# Altium project TU_ADV_PRJ.PrjPcb
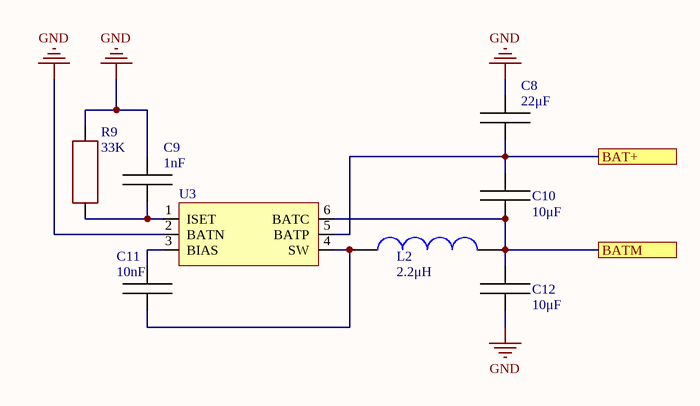
[diagram p0: 2S_BATTERY_BALANCER_SCH.SchDoc]
6 sheets, 59 parts. Net scope: hierarchical (ports join the sheet entries above them; power ports are global).
Board file: TU_ADV_PCB.PcbDoc
Sheets:
  2S_BATTERY_BALANCER_SCH.SchDoc
  2S_BATTERY_CHARGER_SCH.SchDoc
  1S_BATTERY_CHARGER_SCH.SchDoc
  TU_MCU.SchDoc
  2S_BATTERY_PROTECTION_SCH.SchDoc
  FLASHLIGHT_MAIN_SCH.SchDoc

## Sheet 2S_BATTERY_BALANCER_SCH.SchDoc
size 300 x 200 mm

### Parts
C8  value 22μF  [CAP: 1206]  (hidden comment: Cap_1206)
C9  value 1nF  [CAP: 0402]  (hidden comment: Cap_0402)
C10  value 10μF  [CAP: 0603]  (hidden comment: Cap_0603)
C11  value 10nF  [CAP: 0402]  (hidden comment: Cap_0402)
C12  value 10μF  [CAP: 0603]  (hidden comment: Cap_0603)
L2  value 2.2μH  [CD43]  (hidden comment: CD43)
R9  value 33K  [RES: 0402]
U3  ETA3000  [SOT-23-6]  (value not drawn)

### Ports
BAT+, BATM

### Nets
GND: C8.2 C9.2 C12.2 R9.2 U3.2(BATN)
NetC8_1: C8.1 C10.1 U3.5(BATP) ; port BAT+
NetC9_1: C9.1 R9.1 U3.1(ISET)
NetC10_2: C10.2 C12.1 L2.1 U3.6(BATC) ; port BATM
NetC11_1: C11.1 L2.2 U3.4(SW)
NetC11_2: C11.2 U3.3(BIAS)

### Library data of the parts
C8 = Cap_1206: TypeDielectric: X7R(X5R); Voltage: ??V; Package/Case: 1206; Temperature: -55...+125°C(-55...+85°C); Product Category: Capacitors
C9 C11 = Cap_0402: TypeDielectric: X7R(X5R); Voltage: ??V; Package/Case: 0402; Temperature: -55...+125°C(-55...+85°C); Product Category: Capacitors
C10 C12 = Cap_0603: TypeDielectric: X7R(X5R); Voltage: ??V; Package/Case: 0603; Temperature: -55...+125°C(-55...+85°C); Product Category: Capacitors
L2 = CD43: SMD Power Inductor; Manufacturer: SUMIDA; Datasheet: https://products.sumida.com/products/pdf/CD43.pdf; HelpURL: https://aliexpress.ru/item/1005002090028747.html?sku_id=12000018707218161&spm=a2g2w.productlist.search_results.13.550c3fc1XziZsU; Product Category: Inductors
R9 = Resistor_0402: Tolerance: ±5%; Product Category: Resistors; Package/Case: 0402; Temperature: -55...+125°C
U3 = ETA3000: Inductive cell balancer; Manufacturer: ETA; Datasheet: https://datasheetspdf.com/mobile/1424958/ETA/ETA3000/1; HelpURL: https://aliexpress.ru/item/1005002742533593.html?sku_id=12000021935942334; Package/Case: SOT-23-6; Product Category: Battery balancers; Value: ETA3000

## Sheet 2S_BATTERY_CHARGER_SCH.SchDoc
size 300 x 200 mm
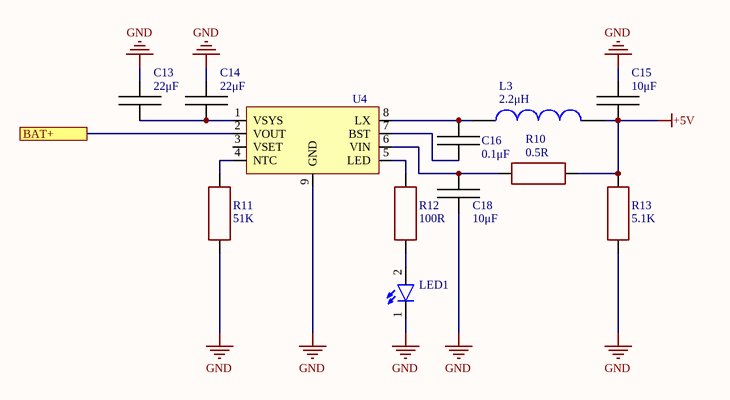
[diagram p1: 2S_BATTERY_CHARGER_SCH.SchDoc]

### Parts
C13  value 22μF  [CAP: 0603]  (hidden comment: Cap_0603)
C14  value 22μF  [CAP: 0603]  (hidden comment: Cap_0603)
C15  value 10μF  [CAP: 0603]  (hidden comment: Cap_0603)
C16  value 0.1μF  [CAP: 0603]  (hidden comment: Cap_0603)
C18  value 10μF  [CAP: 0603]  (hidden comment: Cap_0603)
L3  value 2.2μH  [CD43]  (hidden comment: CD43)
LED1  LED_0603  [LED_0603]  (value not drawn)
R10  value 0.5R  [RES: 0603]  (hidden comment: Resistor_0603)
R11  value 51K  [RES: 0603]  (hidden comment: Resistor_0603)
R12  value 100R  [RES: 0603]  (hidden comment: Resistor_0603)
R13  value 5.1K  [RES: 0603]  (hidden comment: Resistor_0603)
U4  IP2325  [ESOP-8]  (value not drawn)

### Ports
BAT+

### Nets
+5V: C15.2 L3.1 R10.1 R13.2
GND: C13.1 C14.1 C15.1 C18.1 LED1.1 R11.1 R13.1 U4.9(GND)
NetC13_2: C13.2 C14.2 U4.1(VSYS)
NetC16_1: C16.1 U4.7(BST)
NetC16_2: C16.2 L3.2 U4.8(LX)
NetC18_2: C18.2 R10.2 U4.6(VIN)
NetLED1_2: LED1.2 R12.1
NetR11_2: R11.2 U4.4(NTC)
NetR12_2: R12.2 U4.5(LED)
NetU4_2: U4.2(VOUT) ; port BAT+

Not connected (* = marked no-connect by the designer): U4 3(VSET)

### Library data of the parts
C13-C16 C18 = Cap_0603: TypeDielectric: X7R(X5R); Voltage: ??V; Package/Case: 0603; Temperature: -55...+125°C(-55...+85°C); Product Category: Capacitors
L3 = CD43: SMD Power Inductor; Manufacturer: SUMIDA; Datasheet: https://products.sumida.com/products/pdf/CD43.pdf; HelpURL: https://aliexpress.ru/item/1005002090028747.html?sku_id=12000018707218161&spm=a2g2w.productlist.search_results.13.550c3fc1XziZsU; Product Category: Inductors
R10-R13 = Resistor_0603: Tolerance: ±5%; Package/Case: 0603; Temperature: -55...+125°C; Product Category: Resistors
U4 = IP2325: 2s charge Module; Manufacturer: INJOINIC; Datasheet: http://www.injoinic.com/wwwroot/uploads/files/20230913/d8e5944686d69fa501fe83e437133f8d.pdf; HelpURL: https://aliexpress.ru/item/1005005892683023.html?sku_id=12000034732384666; Package/Case: ESOP-8; Product Category: Charge modules; Value: IP2325
LED1 = LED_0603: Product Category: LED; Value: LED_0603

## Sheet 1S_BATTERY_CHARGER_SCH.SchDoc
size 300 x 200 mm
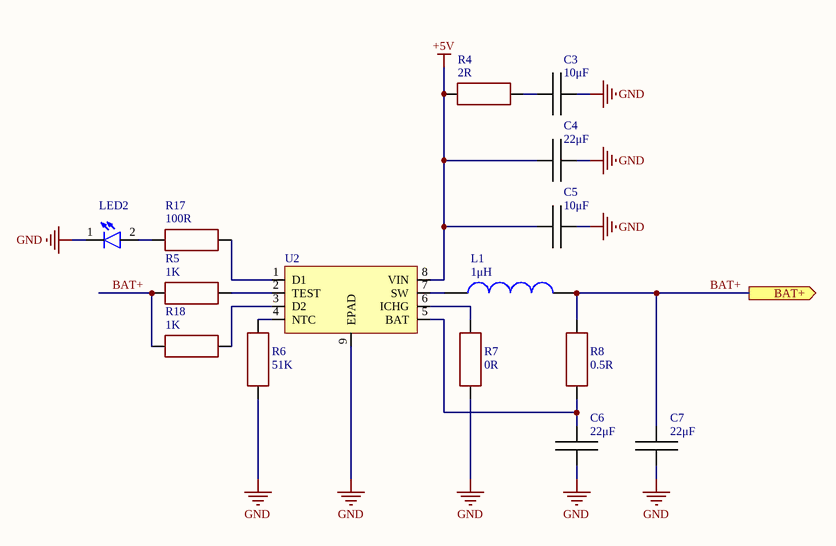
[diagram p2: 1S_BATTERY_CHARGER_SCH.SchDoc]

### Parts
C3  value 10μF  [CAP: 0603]  (hidden comment: Cap_0603)
C4  value 22μF  [CAP: 0603]  (hidden comment: Cap_0603)
C5  value 10μF  [CAP: 0603]  (hidden comment: Cap_0603)
C6  value 22μF  [CAP: 0603]  (hidden comment: Cap_0603)
C7  value 22μF  [CAP: 0603]  (hidden comment: Cap_0603)
L1  value 1μH  [CDRH74]  (hidden comment: CDRH74)
LED2  LED_0603  [LED_0603]  (value not drawn)
R4  value 2R  [RES: 0603]  (hidden comment: Resistor_0603)
R5  value 1K  [RES: 0603]  (hidden comment: Resistor_0603)
R6  value 51K  [RES: 0603]  (hidden comment: Resistor_0603)
R7  value 0R  [RES: 0603]  (hidden comment: Resistor_0603)
R8  value 0.5R  [RES: 0603]  (hidden comment: Resistor_0603)
R17  value 100R  [RES: 0603]  (hidden comment: Resistor_0603)
R18  value 1K  [RES: 0603]  (hidden comment: Resistor_0603)
U2  IP2312  [ESOP-8]  (value not drawn)

### Ports
BAT+ (out)

### Nets
+5V: C4.2 C5.2 R4.1 U2.8(VIN)
GND: C3.1 C4.1 C5.1 C6.2 C7.2 LED2.1 R6.1 R7.2 U2.9(EPAD)
BAT+: C7.1 L1.1 R5.1 R8.2 R18.1 ; port BAT+
NetC3_2: C3.2 R4.2
NetC6_1: C6.1 R8.1 U2.5(BAT)
NetL1_2: L1.2 U2.7(SW)
NetLED2_2: LED2.2 R17.1
NetR5_2: R5.2 U2.2(TEST)
NetR6_2: R6.2 U2.4(NTC)
NetR7_1: R7.1 U2.6(ICHG)
NetR17_2: R17.2 U2.1(D1)
NetR18_2: R18.2 U2.3(D2)

### Library data of the parts
C3-C7 = Cap_0603: TypeDielectric: X7R(X5R); Voltage: ??V; Package/Case: 0603; Temperature: -55...+125°C(-55...+85°C); Product Category: Capacitors
L1 = CDRH74: SMD Power Inductor; Manufacturer: SUMIDA; Datasheet: https://radiokomponent.com.ua/pdf/trans/CDRH74.pdf; HelpURL: https://aliexpress.ru/item/1005004321960425.html?sku_id=12000028751500104&spm=a2g2w.productlist.search_results.7.529b6cc4mPaVds; Product Category: Inductors
R4-R8 R17 R18 = Resistor_0603: Tolerance: ±5%; Package/Case: 0603; Temperature: -55...+125°C; Product Category: Resistors
U2 = IP2312: 1s charge module; Manufacturer: INJOINIC; Datasheet: https://datasheet.lcsc.com/lcsc/2304140030_INJOINIC-IP2312-4V35_C605433.pdf; HelpURL: https://aliexpress.ru/item/1005006314271382.html?spm=a2g2w.favourites.mywishlist.41.12044aa670bhdZ&sku_id=12000036725210626; Package/Case: ESOP-8; Product Category: Charge modules; Value: IP2312
LED2 = LED_0603: Product Category: LED; Value: LED_0603

## Sheet TU_MCU.SchDoc
size 500 x 500 mm
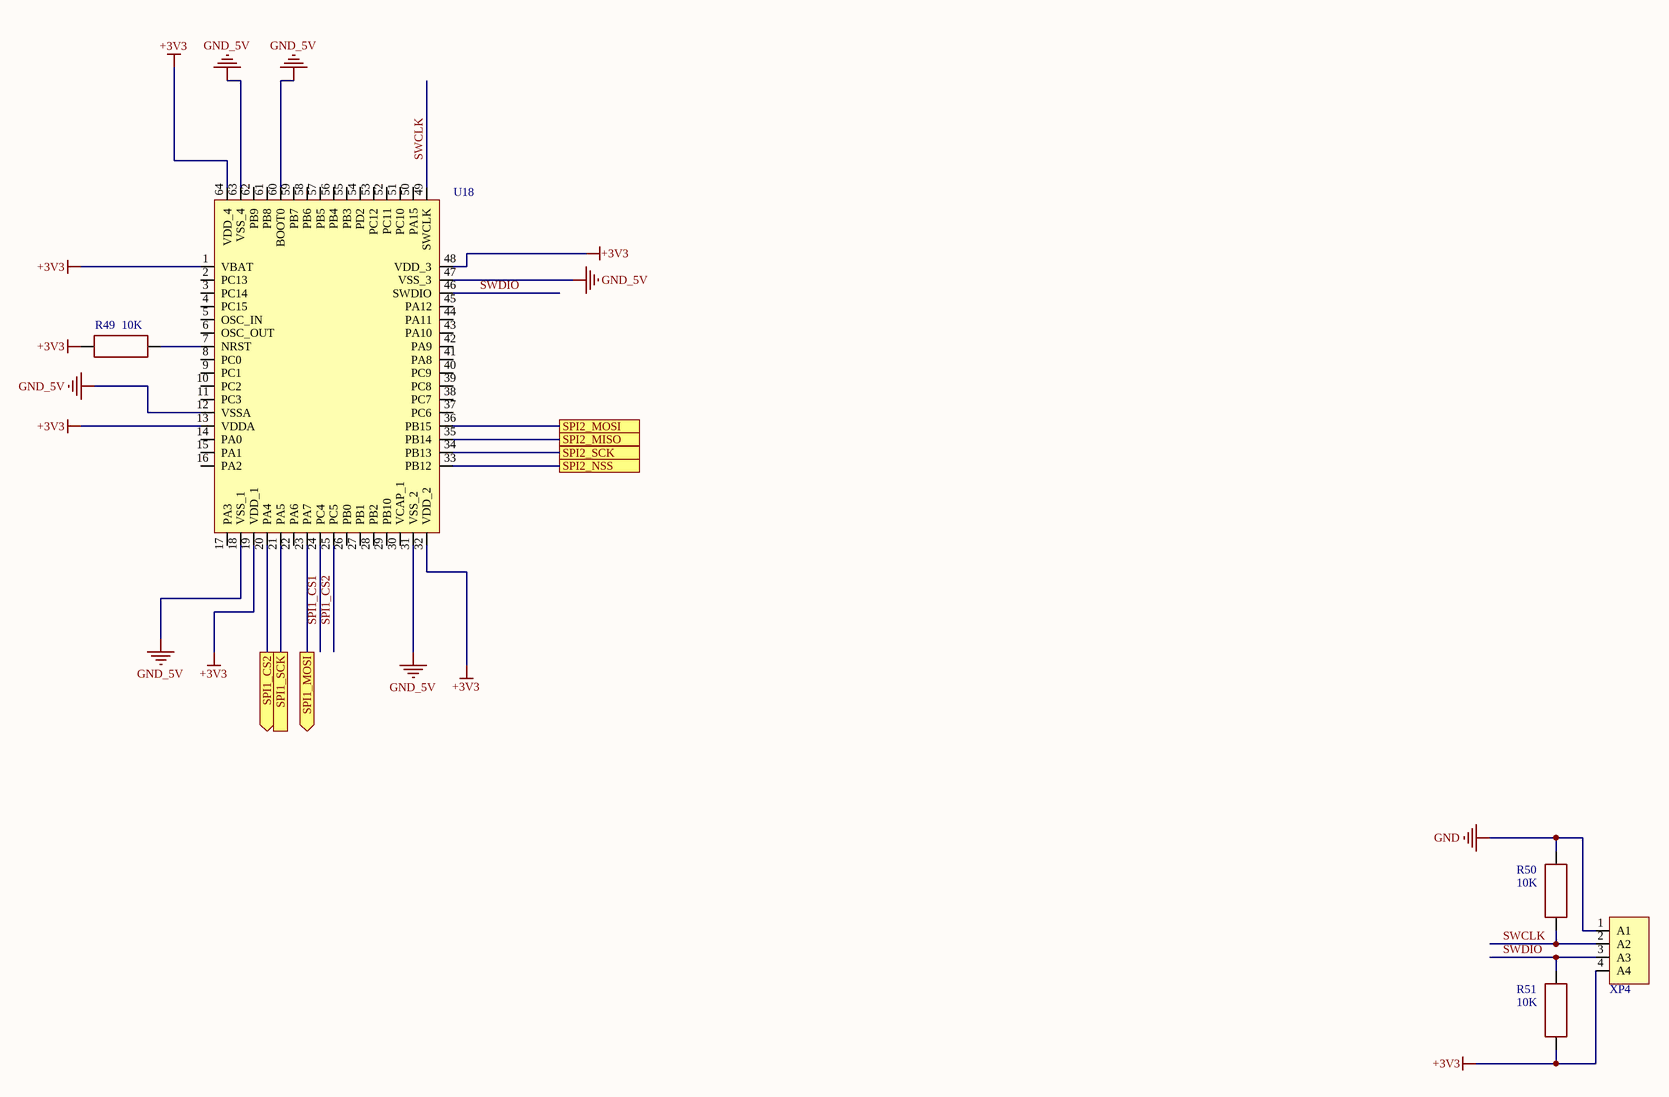
[diagram p3: TU_MCU.SchDoc]

### Parts
R49  value 10K  [RES: 0402]
R50  value 10K  [RES: 0402]
R51  value 10K  [RES: 0402]
U18  STM32F413RGT6  [LQFP-64]  (value not drawn)
XP4  PLS-6 (DS1021-1x6)  [PLS-4 (DS1021-1x4)]  (value not drawn)

### Ports
SPI1_CS2 (out), SPI1_MOSI (out), SPI1_SCK, SPI2_MISO, SPI2_MOSI, SPI2_NSS, SPI2_SCK

### Nets
+3V3: R49.1 R51.2 U18.1(VBAT) U18.13(VDDA) U18.19(VDD_1) U18.32(VDD_2) U18.48(VDD_3) U18.64(VDD_4) XP4.4(A4)
GND: R50.1 XP4.1(A1)
GND_5V: U18.12(VSSA) U18.18(VSS_1) U18.31(VSS_2) U18.47(VSS_3) U18.60(BOOT0) U18.63(VSS_4)
SPI1_CS1: U18.24(PC4)
SPI1_CS2: U18.25(PC5)
SWCLK: R50.2 U18.49(SWCLK) XP4.2(A2)
SWDIO: R51.1 U18.46(SWDIO) XP4.3(A3)
NetR49_2: R49.2 U18.7(NRST)
NetU18_20: U18.20(PA4) ; port SPI1_CS2
NetU18_21: U18.21(PA5) ; port SPI1_SCK
NetU18_23: U18.23(PA7) ; port SPI1_MOSI
NetU18_33: U18.33(PB12) ; port SPI2_NSS
NetU18_34: U18.34(PB13) ; port SPI2_SCK
NetU18_35: U18.35(PB14) ; port SPI2_MISO
NetU18_36: U18.36(PB15) ; port SPI2_MOSI

Not connected (* = marked no-connect by the designer): U18 2(PC13) 3(PC14) 4(PC15) 5(OSC_IN) 6(OSC_OUT) 8(PC0) 9(PC1) 10(PC2) 11(PC3) 14(PA0) 15(PA1) 16(PA2) 17(PA3) 22(PA6) 26(PB0) 27(PB1) 28(PB2) 29(PB10) 30(VCAP_1) 37(PC6) 38(PC7) 39(PC8) 40(PC9) 41(PA8) 42(PA9) 43(PA10) 44(PA11) 45(PA12) 50(PA15) 51(PC10) 52(PC11) 53(PC12) 54(PD2) 55(PB3) 56(PB4) 57(PB5) 58(PB6) 59(PB7) 61(PB8) 62(PB9)

### Library data of the parts
R49-R51 = Resistor_0402: Tolerance: ±5%; Product Category: Resistors; Package/Case: 0402; Temperature: -55...+125°C
U18 = STM32F413RGT6: ARM Microcontrollers - MCU High-performance access line, Arm Cortex-M4 core DSP & FPU, 1 MByte of Flash 100; Manufacturer: STMicroelectronics; Datasheet: https://eu.mouser.com/datasheet/2/389/stm32f413cg-1851205.pdf; HelpURL: https://eu.mouser.com/ProductDetail/STMicroelectronics/STM32F413RGT6?qs=FNcb6ahWXRyREY%252BFzgYY7A%3D%3D; Package/Case: LQFP-64; Product Category: Microcontrollers
XP4 = PLS-4 (DS1021-1x4): Board to Board, Surface Mount, Single row, 6 Positions, 2.54mm, Vertical.; Manufacturer: Connfly; Datasheet: https://static.chipdip.ru/lib/977/DOC005977245.pdf; HelpURL: https://www.chipdip.by/product/pls-4; Product Category: Connectors

## Sheet 2S_BATTERY_PROTECTION_SCH.SchDoc
size 299 x 199 mm
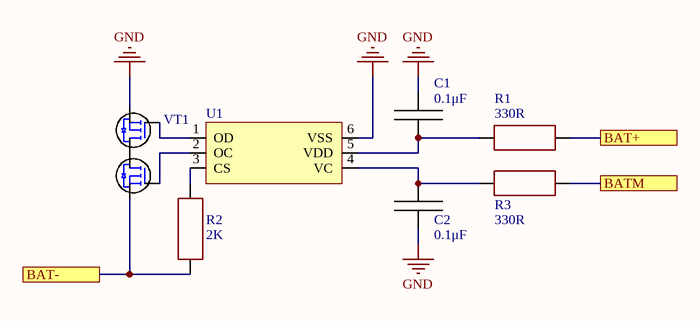
[diagram p4: 2S_BATTERY_PROTECTION_SCH.SchDoc]

### Parts
C1  value 0.1μF  [CAP: 0402]  (hidden comment: Cap_0402)
C2  value 0.1μF  [CAP: 0402]  (hidden comment: Cap_0402)
R1  value 330R  [RES: 0402]
R2  value 2K  [RES: 0402]
R3  value 330R  [RES: 0402]
U1  HY2120  [SOT-23-6]  (value not drawn)
VT1  8205A  [SOT-23-6]  (value not drawn)

### Ports
BAT+, BAT-, BATM

### Nets
GND: C1.2 C2.1 U1.6(VSS) VT1.1
NetC1_1: C1.1 R1.1 U1.5(VDD)
NetC2_2: C2.2 R3.1 U1.4(VC)
NetR1_2: R1.2 ; port BAT+
NetR2_1: R2.1 VT1.3 ; port BAT-
NetR2_2: R2.2 U1.3(CS)
NetR3_2: R3.2 ; port BATM
NetU1_1: U1.1(OD) VT1.6
NetU1_2: U1.2(OC) VT1.4
NetVT1_2: VT1.2 VT1.5

### Library data of the parts
C1 C2 = Cap_0402: TypeDielectric: X7R(X5R); Voltage: ??V; Package/Case: 0402; Temperature: -55...+125°C(-55...+85°C); Product Category: Capacitors
R1-R3 = Resistor_0402: Tolerance: ±5%; Product Category: Resistors; Package/Case: 0402; Temperature: -55...+125°C
U1 = HY2120: 2-cell lithium-ion/lithium polymer rechargeable battery / protection; Manufacturer: HYCON; Datasheet: https://static.chipdip.ru/lib/671/DOC012671868.pdf; HelpURL: https://aliexpress.ru/item/32858079670.html?sku_id=65323825149&spm=a2g2w.productlist.search_results.5.6e4d5adf5VsdVe; Package/Case: SOT-23-6; Product Category: Battery protection; Value: HY2120
VT1 = 8205A: MOSFET N-CHANNEL 20V 5A; pin to pad: 2>2+5 5>2+5; Manufacturer: UMW; Datasheet: https://static.chipdip.ru/lib/303/DOC021303523.pdf; HelpURL: https://www.chipdip.by/product/8205a; Package/Case: SOT-23-6; Product Category: MOSFET; Value: 8205A

## Sheet FLASHLIGHT_MAIN_SCH.SchDoc
size 1651 x 1651 mm
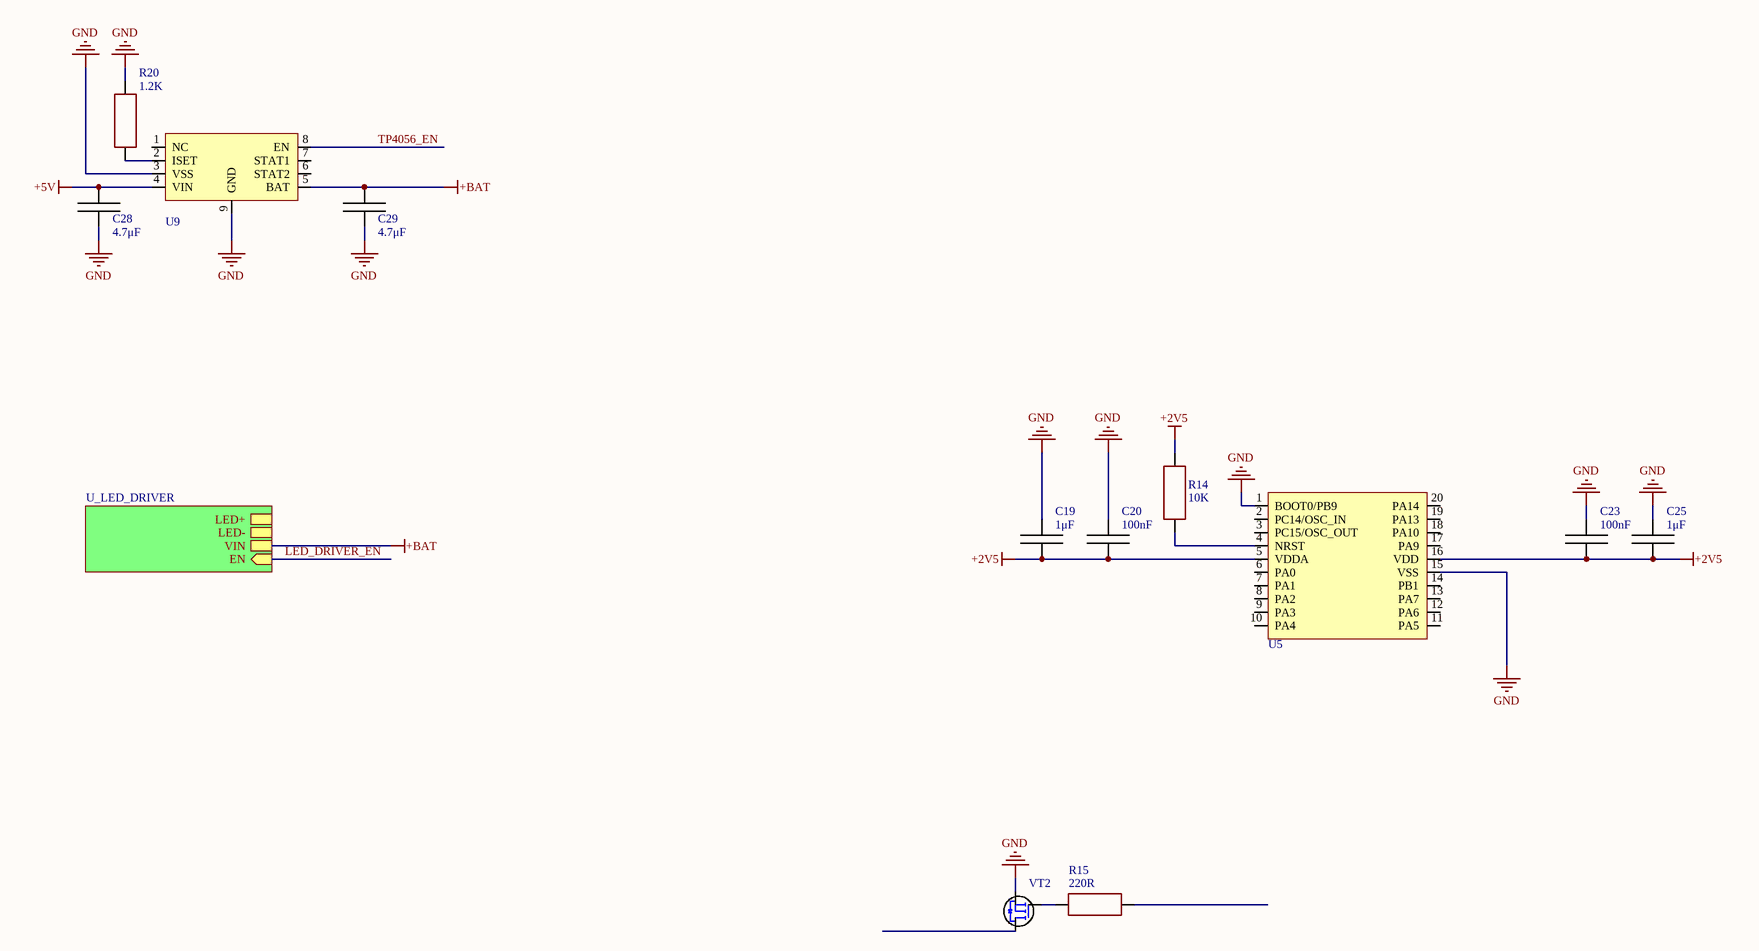
[diagram p5: FLASHLIGHT_MAIN_SCH.SchDoc]

### Parts
C19  value 1μF  [CAP: 0402]  (hidden comment: Cap_0402)
C20  value 100nF  [CAP: 0402]  (hidden comment: Cap_0402)
C23  value 100nF  [CAP: 0402]  (hidden comment: Cap_0402)
C25  value 1μF  [CAP: 0402]  (hidden comment: Cap_0402)
C28  value 4.7μF  [CAP: 0402]  (hidden comment: Cap_0402)
C29  value 4.7μF  [CAP: 0402]  (hidden comment: Cap_0402)
R14  value 10K  [RES: 0402]
R15  value 220R  [RES: 0402]
R20  value 1.2K  [RES: 0402]
U5  STM32L011F4P6TR  [TSSOP-20]  (value not drawn)
U9  TP4056  [ESOP-8]  (value not drawn)
VT2  IRLML6344  [SOT-23-3]  (value not drawn)

### Sub-sheets
U_LED_DRIVER = LED_DRIVER.SchDoc (file not in this document): LED+, VIN, LED-, EN (in)

### Nets
+2V5: C19.1 C20.2 C23.2 C25.1 R14.1 U5.5(VDDA) U5.16(VDD)
+5V: C28.2 U9.4(VIN)
+BAT: C29.2 U9.5(BAT) ; sheet U_LED_DRIVER/VIN
GND: C19.2 C20.1 C23.1 C25.2 C28.1 C29.1 R20.2 U5.1(BOOT0/PB9) U5.15(VSS) U9.3(VSS) U9.9(GND) VT2.2
LED_DRIVER_EN: sheet U_LED_DRIVER/EN
TP4056_EN: U9.8(EN)
NetR14_2: R14.2 U5.4(NRST)
NetR15_1: R15.1 VT2.1
NetR20_1: R20.1 U9.2(ISET)

Not connected (* = marked no-connect by the designer): R15 2; U5 2(PC14/OSC_IN) 3(PC15/OSC_OUT) 6(PA0) 7(PA1) 8(PA2) 9(PA3) 10(PA4) 11(PA5) 12(PA6) 13(PA7) 14(PB1) 17(PA9) 18(PA10) 19(PA13) 20(PA14); U9 1(NC) 6(STAT2) 7(STAT1); VT2 3

### Library data of the parts
C19 C20 C23 C25 = Cap_0402: TypeDielectric: X7R(X5R); Voltage: ??V; Package/Case: 0402; Temperature: -55...+125°C(-55...+85°C); Product Category: Capacitors
C28 C29 = Cap_0402: TypeDielectric: X7R(X5R); Voltage: X5R 6.3В 20%; Package/Case: 0402; Temperature: -55...+125°C(-55...+85°C); Product Category: Capacitors
R14 R15 R20 = Resistor_0402: Tolerance: ±5%; Product Category: Resistors; Package/Case: 0402; Temperature: -55...+125°C
U5 = STM32L011F4P6TR: Manufacturer: STMicroelectronics; Datasheet: https://static.chipdip.ru/lib/696/DOC011696872.pdf; HelpURL: https://www.chipdip.by/product0/8007122304; Package/Case: TSSOP-20; Product Category: Microcontrollers; Value: STM32L011F4P6TR
U9 = TP4056: 1s charge module; Manufacturer: UMW; Datasheet: https://static.chipdip.ru/lib/848/DOC018848830.pdf; HelpURL: https://www.chipdip.by/product/tp4056-umw; Package/Case: ESOP-8; Product Category: Charge modules; Value: TP4056
VT2 = IRLML6344: MOSFET N-CHANNEL 30V 5A; Manufacturer: Fairchild; Analogue: NX7002AK; Datasheet: https://static.chipdip.ru/lib/015/DOC024015069.pdf; HelpURL: https://eu.mouser.com/ProductDetail/onsemi-Fairchild/2N7002?qs=0dwsXDNhqlz66WJJhrTFjQ%3D%3D; Package/Case: SOT-23; Product Category: MOSFET; Value: IRLML6344

## Nets that join several sheets
+5V: 2S_BATTERY_CHARGER_SCH (C15.2 L3.1 R10.1 R13.2), 1S_BATTERY_CHARGER_SCH (C4.2 C5.2 R4.1 U2.8), FLASHLIGHT_MAIN_SCH (C28.2 U9.4)
GND: 2S_BATTERY_BALANCER_SCH (5 pins), 2S_BATTERY_CHARGER_SCH (8 pins), 1S_BATTERY_CHARGER_SCH (9 pins), TU_MCU (R50.1 XP4.1), 2S_BATTERY_PROTECTION_SCH (C1.2 C2.1 U1.6 VT1.1), FLASHLIGHT_MAIN_SCH (12 pins)